# Altium schematic sheet TX2.SchDoc
size A
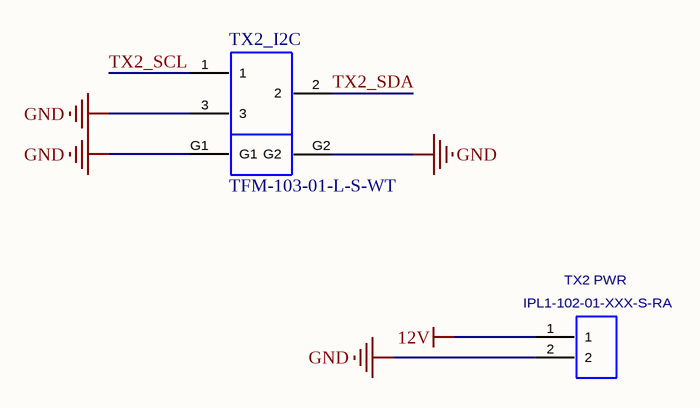
[diagram p0: TX2.SchDoc]

## Parts
TX2_I2C  TFM-103-01-L-S-WT  [TFM-103-01-L-S-WT]
TX2_PWR  IPL1-102-01-XXX-S-RA  [IPL1-102-01-XXX-S-RA]

## Nets
12V: TX2_PWR.1
GND: TX2_I2C.3 TX2_I2C.G1 TX2_I2C.G2 TX2_PWR.2
TX2_SCL: TX2_I2C.1
TX2_SDA: TX2_I2C.2

## Library data of the parts
TX2_PWR = IPL1-102-01-XXX-S-RA: Terminal Assembly, Single Row, Right Angle, Thru-Hole, 2 Pins.; MANUFACTURER: SAMTEC; CREATED: February 14, 2016 - Wendy Xin; PCB DECAL: IPL1-102-01-XXX-S-RA